# Altium schematic sheet Inverted_HS_LS_switch_HI_PWR.SchDoc: Data Logger - Inverted HS LS Hi Power Switches
size A4; DocumentNumber: DL-MB-10; SheetNumber: 10; SheetTotal: 11
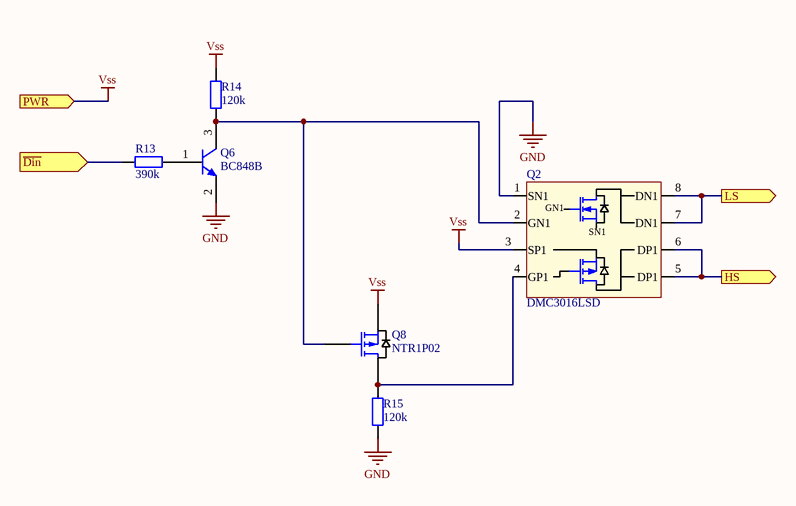
[diagram p0: Inverted_HS_LS_switch_HI_PWR.SchDoc]

## Parts
Q2  DMC3016LSD  [SOIC-8_SOIC127P600X175-8N]
Q6  BC848B  [SOT23_N]
Q8  NTR1P02  [SOT23_N]
R13  390k  [RES-1206_M]
R14  120k  [RES-1206_M]
R15  120k  [RES-1206_M]

## Ports
HS (out), LS (out), PWR (in), ~{Din} (in)

## Nets
GND: Q2.1(SN1) Q6.2(E) R15.2
Vss: Q2.3(SP1) Q8.2(S) R14.2 ; port PWR
~{Din}: R13.1 ; port ~{Din}
HS: Q2.5(DP1) Q2.6(DP1) ; port HS
LS: Q2.7(DN1) Q2.8(DN1) ; port LS
NetQ2_2: Q2.2(GN1) Q6.3(C) Q8.1(G) R14.1
NetQ2_4: Q2.4(GP1) Q8.3(D) R15.1
NetQ6_1: Q6.1(B) R13.2

## Notes on the sheet
- Title
- Size
- Date:
- A4
- Number
- Time:
- Sheet
- of
- Revision
- File:
- Drawn By:

## Library data of the parts
Q2 = DMC3016LSD: MOSFET N/P-CH 30V 8.2A/6.2A 8SO; Manufacturer: Diodes; Manufacturer Part Number: DMC3016LSD-13; Continuous Drain Current (ID): 6.2A; Rds On Max: 16mR; Input Capacitance: 1.415nF; Max Power Dissipation: 1.2W; Number of Channels: 2; Drain to Source Resistance: 30mR; Gate to Source Voltage (Vgs): 20V; Fall Time: 40.4ns; Rise Time: 17.1ns; Turn-Off Delay Time: 60.5ns; Turn-On Delay Time: 9.7ns; FET Type: N and P-Channel; RoHS: Yes; Category: MOSFETs; Mount: Surface Mount; Case/Package: SOIC; Number of Pins: 8; Weight: 0.00261oz; Min Operating Temperature: -55°C; Max Operating Temperature: 150°C; Packaging: Tape and Reel; Drain to Source Voltage (Vdss): 30V; Drain to Source Breakdown Voltage: 30V; Package Quantity: 2500; Lead Free: Lead Free; RoHS Compliant: Yes; ComponentLink1URL: http://www.mouser.com/ds/2/115/DMC3016LSD-364397.pdf?src-supplier=Mouser; ComponentLink1Description: http://www.mouser.com/ds/2/115/DMC3016LSD-364397.pdf?src-supplier=Mouser; ComponentLink2URL: https://www.diodes.com/assets/Datasheets/DMC3016LSD.pdf?src-supplier=Digi-Key; ComponentLink2Description: https://www.diodes.com/assets/Datasheets/DMC3016LSD.pdf?src-supplier=Digi-Key
Q6 = BC848B: NPN Silicon AF Transistor, 30 V VCEO, 100 mA IC, SOT23, Reel, Green; Manufacturer: Infineon; fT (typ): 250 MHz; Green: TRUE; IBM (max): 200 mA; IC (max): 100 mA; ICBO (max): 15 nA; Ptot (max): 330 mW; VCBO (max): 30 V; VEBO (max): 6 V; PackageVersion: Apr-08; PackageReference: SOT23; PackageDescription: 3-Pin Small Outline Transistor Package, 1.3 x 2.9 mm Body, 0.95 mm Pitch; ICM (max): 200 mA; Packing: Reel; Polarity: NPN; VCEO (max): 30 V; Mounting Technology: Surface Mount; PartNumber: BC848B; ComponentLink1Description: Manufacturer URL; ComponentLink1URL: http://www.infineon.com/; ComponentLink2Description: Datasheet; ComponentLink2URL: http://www.infineon.com/dgdl/bc847series_bc848series_bc849series_bc850series.pdf?folderId=db3a304314dca389011541d30fa21656&fileId=db3a304314dca389011541d4630a1657; ComponentLink3Description: Package Specification; ComponentLink3URL: http://www.infineon.com/dgdl/SOT23-Package_Overview.pdf?folderId=db3a30431936bc4b0119532290053c66&fileId=db3a30431936bc4b0119533468123c85
Q8 = MOSFET-P: NTR1P02T1G P-channel MOSFET Transistor; 1 A; 20 V; 3-Pin SOT-23; Manufacturer: ON Semiconductor; Rise Time: 9ns; Continuous Drain Current (ID): 1A; Gate to Source Voltage (Vgs): 20V; Power Dissipation: 400mW; Drain to Source Resistance: 148mR; Element Configuration: Single; Drain to Source Breakdown Voltage: -20V; Rds On Max: 180mR; Input Capacitance: 165pF; Current Rating: -1A; Number of Elements: 1; Turn-On Delay Time: 7ns; Threshold Voltage: -1.9V; Manufacturer Part Number: NTR1P02; RoHS: Yes; Category: MOSFETs; Case/Package: SOT-23-3; Number of Pins: 3; Contact Plating: Tin,Matte; Min Operating Temperature: -55°C; Max Operating Temperature: 150°C; Fall Time: 9ns; Turn-Off Delay Time: 9ns; Package Quantity: 1; Packaging: Tape and Reel; Max Power Dissipation: 400mW; Voltage Rating (DC): -20V; Drain to Source Voltage (Vdss): 20V; On-State Resistance: 148MR; Nominal Vgs: -1.9V; Length: 2.9mm; Width: 1.3mm; Height: 0.94mm; Radiation Hardening: No; RoHS Compliant: Yes; Lead Free: Lead Free; REACH SVHC: No SVHC; ComponentLink1URL: https://datasheet.ciiva.com/22641/1708311-22641684.pdf?src-supplier=Element14; ComponentLink1Description: https://datasheet.ciiva.com/22641/1708311-22641684.pdf?src-supplier=Element14; ComponentLink2URL: https://datasheet.ciiva.com/936/ntr1p02t1-d-936864.pdf?src-supplier=Digi-Key; ComponentLink2Description: https://datasheet.ciiva.com/936/ntr1p02t1-d-936864.pdf?src-supplier=Digi-Key; ComponentLink3URL: https://datasheet.ciiva.com/22641/1708311-22641686.pdf?src-supplier=Element14; ComponentLink3Description: https://datasheet.ciiva.com/22641/1708311-22641686.pdf?src-supplier=Element14; ComponentLink4URL: https://datasheet.ciiva.com/16386/ntr1p02t1-d-16386335.pdf?src-supplier=Future+Electronics; ComponentLink4Description: https://datasheet.ciiva.com/16386/ntr1p02t1-d-16386335.pdf?src-supplier=Future+Electronics; ComponentLink5URL: https://datasheet.ciiva.com/26145/ntr1p02t1-d-26145674.pdf?src-supplier=Avnet+Europe; ComponentLink5Description: https://datasheet.ciiva.com/26145/ntr1p02t1-d-26145674.pdf?src-supplier=Avnet+Europe; ComponentLink6URL: https://datasheet.ciiva.com/11168/ntr1p02t1-d-11168174.pdf?src-supplier=Avnet; ComponentLink6Description: https://datasheet.ciiva.com/11168/ntr1p02t1-d-11168174.pdf?src-supplier=Avnet; ComponentLink7URL: https://datasheet.ciiva.com/936/ntr1p02t1-d-936865.pdf?src-supplier=Digi-Key; ComponentLink7Description: https://datasheet.ciiva.com/936/ntr1p02t1-d-936865.pdf?src-supplier=Digi-Key
R13-R15 = Res2: Resistor; Published: 8-Jun-2000; LatestRevisionDate: 17-Jul-2002; LatestRevisionNote: Re-released for DXP Platform.; PackageReference: 1206; Publisher: Altium Limited; PackageDescription: Chip Resistor 1206 Case Size
  R13: Value: 390k
  R14 R15: Value: 120k